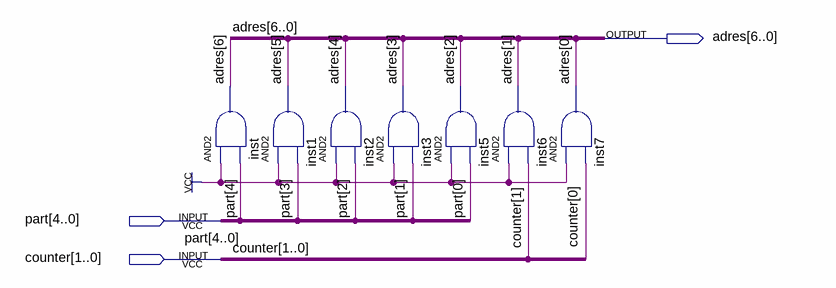
[diagram p0: schematic sheet]
// Quartus schematic reverseAdapter.bdf as structural Verilog: 7 symbols, 3 pins
module reverseAdapter (
  input  [4:0] part,
  input  [1:0] counter,
  output [6:0] adres
);

  and inst (adres[6], 1'b1, part[4]);
  and inst1 (adres[5], 1'b1, part[3]);
  and inst2 (adres[4], 1'b1, part[2]);
  and inst3 (adres[3], 1'b1, part[1]);
  and inst5 (adres[2], 1'b1, part[0]);
  and inst6 (adres[1], 1'b1, counter[1]);
  and inst7 (adres[0], 1'b1, counter[0]);
endmodule
